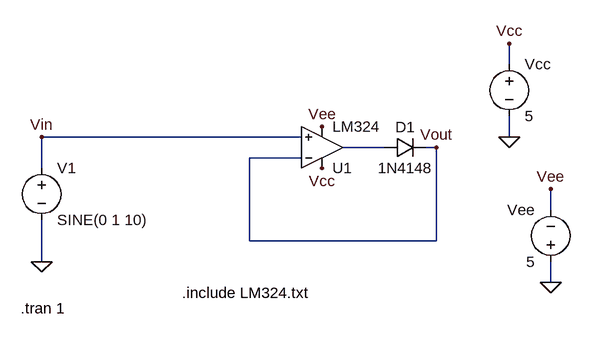
[diagram p0: schematic LM324_SuperDiode.asc]
LM324_SuperDiode.asc, the LTspice schematic file:
Version 4
SHEET 1 880 680
WIRE 480 16 480 -16
WIRE 160 128 -240 128
WIRE 480 128 480 96
WIRE 288 144 224 144
WIRE 368 144 352 144
WIRE 160 160 80 160
WIRE -240 176 -240 128
WIRE 544 240 544 208
WIRE 80 288 80 160
WIRE 368 288 368 144
WIRE 368 288 80 288
WIRE -240 320 -240 256
WIRE 544 352 544 320
FLAG -240 320 0
FLAG 480 -16 Vcc
FLAG 480 128 0
FLAG 544 352 0
FLAG 544 208 Vee
FLAG 192 112 Vee
FLAG 192 176 Vcc
FLAG -240 128 Vin
FLAG 368 144 Vout
SYMBOL voltage -240 160 R0
WINDOW 123 0 0 Left 0
WINDOW 39 0 0 Left 0
SYMATTR InstName V1
SYMATTR Value SINE(0 1 10)
SYMBOL voltage 480 0 R0
WINDOW 123 0 0 Left 0
WINDOW 39 0 0 Left 0
SYMATTR InstName Vcc
SYMATTR Value 5
SYMBOL voltage 544 336 R180
WINDOW 0 24 96 Left 2
WINDOW 3 24 16 Left 2
WINDOW 123 0 0 Left 0
WINDOW 39 0 0 Left 0
SYMATTR InstName Vee
SYMATTR Value 5
SYMBOL OpAmps\\opamp2 192 208 M180
SYMATTR InstName U1
SYMATTR Value LM324
SYMBOL diode 288 160 R270
WINDOW 0 32 32 VTop 2
WINDOW 3 0 32 VBottom 2
SYMATTR InstName D1
SYMATTR Value 1N4148
TEXT -24 368 Left 2 !.include LM324.txt
TEXT -272 392 Left 2 !.tran 1

The netlist it stands for:
* LM324_SuperDiode.asc
V1 Vin 0 SINE(0 1 10)
Vcc Vcc 0 5
Vee 0 Vee 5
XU1 Vin Vout Vcc Vee N001 LM324  ; pins In+ In- V+ V- OUT
D1 N001 Vout 1N4148
.model D D
.lib standard.dio
.include LM324.txt
.tran 1
.backanno
.end